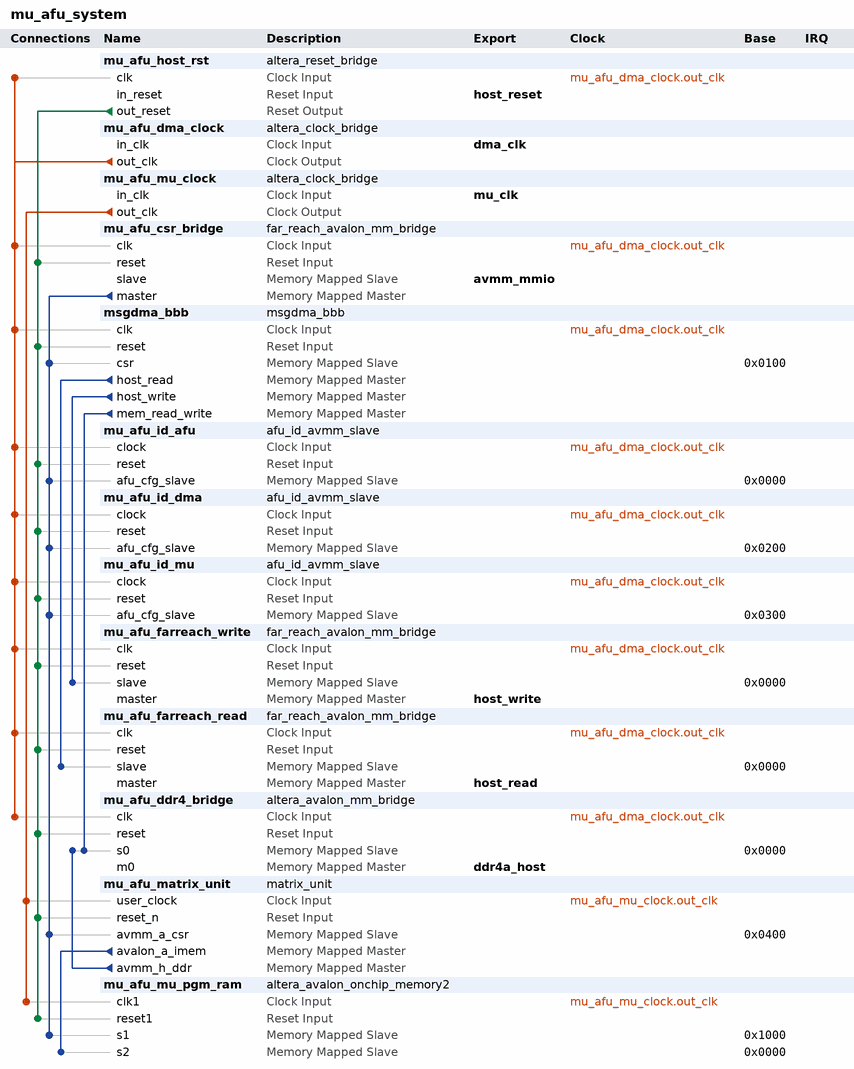
[diagram p0: system contents]
# Platform Designer (Qsys) system mu_afu_system, Stratix 10 1SX280HN2F43E2VG
# Parameters at their usual value, and those the tool derives, are not listed.
package require -exact qsys 1.0
create_system mu_afu_system
set_project_property DEVICE_FAMILY {Stratix 10}
set_project_property DEVICE 1SX280HN2F43E2VG

add_component mu_afu_host_rst ip/mu_afu_system/mu_afu_host_rst.ip altera_reset_bridge mu_afu_host_rst 19.1
load_component mu_afu_host_rst
set_component_parameter_value ACTIVE_LOW_RESET 0
set_component_parameter_value SYNCHRONOUS_EDGES both
set_component_parameter_value SYNC_RESET 0
save_component

add_component mu_afu_dma_clock ip/mu_afu_system/mu_afu_dma_clock.ip altera_clock_bridge mu_afu_dma_clock 19.1
load_component mu_afu_dma_clock
set_component_parameter_value DERIVED_CLOCK_RATE 0
set_component_parameter_value EXPLICIT_CLOCK_RATE 250000000
save_component

add_component mu_afu_mu_clock ip/mu_afu_system/mu_afu_mu_clock.ip altera_clock_bridge mu_afu_mu_clock 19.1
load_component mu_afu_mu_clock
set_component_parameter_value DERIVED_CLOCK_RATE 0
set_component_parameter_value EXPLICIT_CLOCK_RATE 125000000
save_component

add_component mu_afu_csr_bridge ip/mu_afu_system/mu_afu_csr_bridge.ip far_reach_avalon_mm_bridge mu_afu_csr_bridge 1.0
load_component mu_afu_csr_bridge
set_component_parameter_value DATA_WIDTH 64
set_component_parameter_value ADDRESS_WIDTH 48
set_component_parameter_value BURST_COUNT 1
set_component_parameter_value BURST_WIDTH 1
set_component_parameter_value RESPONSE_ENABLE 0
set_component_parameter_value READ_ENABLE 1
set_component_parameter_value MAX_PENDING_READS 64
set_component_parameter_value WRITE_ENABLE 1
set_component_parameter_value MAX_PENDING_WRITES 64
set_component_parameter_value WRITE_TRACKING_ENABLE 0
set_component_parameter_value DOWNSTREAM_PIPELINE_STAGES 2
set_component_parameter_value WAITREQUEST_PIPELINE_STAGES 2
set_component_parameter_value UPSTREAM_PIPELINE_STAGES 2
set_component_parameter_value SKID_FIFO_DEPTH 16
set_component_parameter_value SKID_FIFO_ALMOST_FULL_LEVEL 11
set_component_parameter_value SKID_FIFO_CLOCK_CROSSING_ENABLE 0
set_component_parameter_value UPSTREAM_CLOCK_CROSSING_ENABLE 0
set_component_parameter_value UPSTREAM_FIFO_DEPTH 32
set_component_parameter_value UPSTREAM_FIFO_ALMOST_FULL_LEVEL 10
save_component

add_component msgdma_bbb /home/u204427/ternary_matmul/afu/pd/dma_bbb/msgdma_bbb.qsys msgdma_bbb msgdma_bbb 

add_component mu_afu_id_afu ip/mu_afu_system/mu_afu_id_afu.ip afu_id_avmm_slave mu_afu_id_afu 1.0
load_component mu_afu_id_afu
set_component_parameter_value AFU_ID_H 13801922474960440300
set_component_parameter_value AFU_ID_L 11423231018923234662
set_component_parameter_value DFH_FEATURE_TYPE 1
set_component_parameter_value DFH_AFU_MINOR_REV 0
set_component_parameter_value DFH_AFU_MAJOR_REV 0
set_component_parameter_value DFH_END_OF_LIST 0
set_component_parameter_value DFH_NEXT_OFFSET 256
set_component_parameter_value DFH_FEATURE_ID 0
set_component_parameter_value NEXT_AFU_OFFSET 0
set_component_parameter_value CREATE_SCRATCH_REG 0
save_component

add_component mu_afu_id_dma ip/mu_afu_system/mu_afu_id_dma.ip afu_id_avmm_slave mu_afu_id_dma 1.0
load_component mu_afu_id_dma
set_component_parameter_value AFU_ID_H 15713484274600791587
set_component_parameter_value AFU_ID_L 10447905468530561839
set_component_parameter_value DFH_FEATURE_TYPE 2
set_component_parameter_value DFH_AFU_MINOR_REV 0
set_component_parameter_value DFH_AFU_MAJOR_REV 0
set_component_parameter_value DFH_END_OF_LIST 0
set_component_parameter_value DFH_NEXT_OFFSET 256
set_component_parameter_value DFH_FEATURE_ID 0
set_component_parameter_value NEXT_AFU_OFFSET 0
set_component_parameter_value CREATE_SCRATCH_REG 0
save_component

add_component mu_afu_id_mu ip/mu_afu_system/mu_afu_id_mu.ip afu_id_avmm_slave mu_afu_id_mu 1.0
load_component mu_afu_id_mu
set_component_parameter_value AFU_ID_H 13738515147855644312
set_component_parameter_value AFU_ID_L 11395495359027184417
set_component_parameter_value DFH_FEATURE_TYPE 3
set_component_parameter_value DFH_AFU_MINOR_REV 0
set_component_parameter_value DFH_AFU_MAJOR_REV 1
set_component_parameter_value DFH_END_OF_LIST 1
set_component_parameter_value DFH_NEXT_OFFSET 3840
set_component_parameter_value DFH_FEATURE_ID 2730
set_component_parameter_value NEXT_AFU_OFFSET 0
set_component_parameter_value CREATE_SCRATCH_REG 0
save_component

add_component mu_afu_farreach_write ip/mu_afu_system/mu_afu_farreach_write.ip far_reach_avalon_mm_bridge mu_afu_farreach_write 1.0
load_component mu_afu_farreach_write
set_component_parameter_value DATA_WIDTH 512
set_component_parameter_value ADDRESS_WIDTH 48
set_component_parameter_value BURST_COUNT 4
set_component_parameter_value BURST_WIDTH 3
set_component_parameter_value RESPONSE_ENABLE 1
set_component_parameter_value READ_ENABLE 0
set_component_parameter_value MAX_PENDING_READS 64
set_component_parameter_value WRITE_ENABLE 1
set_component_parameter_value MAX_PENDING_WRITES 64
set_component_parameter_value WRITE_TRACKING_ENABLE 1
set_component_parameter_value DOWNSTREAM_PIPELINE_STAGES 2
set_component_parameter_value WAITREQUEST_PIPELINE_STAGES 2
set_component_parameter_value UPSTREAM_PIPELINE_STAGES 2
set_component_parameter_value SKID_FIFO_DEPTH 16
set_component_parameter_value SKID_FIFO_ALMOST_FULL_LEVEL 11
set_component_parameter_value SKID_FIFO_CLOCK_CROSSING_ENABLE 0
set_component_parameter_value UPSTREAM_CLOCK_CROSSING_ENABLE 0
set_component_parameter_value UPSTREAM_FIFO_DEPTH 32
set_component_parameter_value UPSTREAM_FIFO_ALMOST_FULL_LEVEL 10
save_component

add_component mu_afu_farreach_read ip/mu_afu_system/mu_afu_farreach_read.ip far_reach_avalon_mm_bridge mu_afu_farreach_read 1.0
load_component mu_afu_farreach_read
set_component_parameter_value DATA_WIDTH 512
set_component_parameter_value ADDRESS_WIDTH 48
set_component_parameter_value BURST_COUNT 4
set_component_parameter_value BURST_WIDTH 3
set_component_parameter_value RESPONSE_ENABLE 0
set_component_parameter_value READ_ENABLE 1
set_component_parameter_value MAX_PENDING_READS 64
set_component_parameter_value WRITE_ENABLE 0
set_component_parameter_value MAX_PENDING_WRITES 64
set_component_parameter_value WRITE_TRACKING_ENABLE 0
set_component_parameter_value DOWNSTREAM_PIPELINE_STAGES 2
set_component_parameter_value WAITREQUEST_PIPELINE_STAGES 2
set_component_parameter_value UPSTREAM_PIPELINE_STAGES 2
set_component_parameter_value SKID_FIFO_DEPTH 16
set_component_parameter_value SKID_FIFO_ALMOST_FULL_LEVEL 11
set_component_parameter_value SKID_FIFO_CLOCK_CROSSING_ENABLE 0
set_component_parameter_value UPSTREAM_CLOCK_CROSSING_ENABLE 0
set_component_parameter_value UPSTREAM_FIFO_DEPTH 32
set_component_parameter_value UPSTREAM_FIFO_ALMOST_FULL_LEVEL 10
save_component

add_component mu_afu_ddr4_bridge ip/mu_afu_system/mu_afu_ddr4_bridge.ip altera_avalon_mm_bridge mu_afu_ddr4_bridge 19.1
load_component mu_afu_ddr4_bridge
set_component_parameter_value DATA_WIDTH 512
set_component_parameter_value ADDRESS_WIDTH 33
set_component_parameter_value USE_AUTO_ADDRESS_WIDTH 0
set_component_parameter_value ADDRESS_UNITS SYMBOLS
set_component_parameter_value MAX_BURST_SIZE 4
set_component_parameter_value MAX_PENDING_RESPONSES 64
set_component_parameter_value SYNC_RESET 0
save_component

add_component mu_afu_matrix_unit ip/mu_afu_system/mu_afu_matrix_unit.ip matrix_unit mu_afu_matrix_unit 1.0
load_component mu_afu_matrix_unit
set_component_parameter_value ddr_addr_w 33
set_component_parameter_value ddr_data_w 8
set_component_parameter_value csr_addr_w 8
set_component_parameter_value csr_data_w 32
set_component_parameter_value imem_w_instr 64
set_component_parameter_value imem_w_addr 6
save_component

add_component mu_afu_mu_pgm_ram ip/mu_afu_system/mu_afu_mu_pgm_ram.ip altera_avalon_onchip_memory2 mu_afu_mu_pgm_ram 19.1
load_component mu_afu_mu_pgm_ram
set_component_parameter_value blockType M20K
set_component_parameter_value dataWidth 64
set_component_parameter_value dualPort true
set_component_parameter_value initMemContent false
set_component_parameter_value initializationFileName onchip_mem.hex
set_component_parameter_value memorySize 512
set_component_parameter_value resetrequest_enabled false
save_component

# connections
add_connection mu_afu_dma_clock.out_clk msgdma_bbb.clk clock
add_connection mu_afu_dma_clock.out_clk mu_afu_csr_bridge.clk clock
add_connection mu_afu_dma_clock.out_clk mu_afu_ddr4_bridge.clk clock
add_connection mu_afu_dma_clock.out_clk mu_afu_farreach_read.clk clock
add_connection mu_afu_dma_clock.out_clk mu_afu_farreach_write.clk clock
add_connection mu_afu_dma_clock.out_clk mu_afu_host_rst.clk clock
add_connection mu_afu_dma_clock.out_clk mu_afu_id_afu.clock clock
add_connection mu_afu_dma_clock.out_clk mu_afu_id_dma.clock clock
add_connection mu_afu_dma_clock.out_clk mu_afu_id_mu.clock clock
add_connection mu_afu_mu_clock.out_clk mu_afu_matrix_unit.user_clock clock
add_connection mu_afu_mu_clock.out_clk mu_afu_mu_pgm_ram.clk1 clock
add_connection mu_afu_host_rst.out_reset msgdma_bbb.reset reset
add_connection mu_afu_host_rst.out_reset mu_afu_csr_bridge.reset reset
add_connection mu_afu_host_rst.out_reset mu_afu_ddr4_bridge.reset reset
add_connection mu_afu_host_rst.out_reset mu_afu_farreach_read.reset reset
add_connection mu_afu_host_rst.out_reset mu_afu_farreach_write.reset reset
add_connection mu_afu_host_rst.out_reset mu_afu_id_afu.reset reset
add_connection mu_afu_host_rst.out_reset mu_afu_id_dma.reset reset
add_connection mu_afu_host_rst.out_reset mu_afu_id_mu.reset reset
add_connection mu_afu_host_rst.out_reset mu_afu_matrix_unit.reset_n reset
add_connection mu_afu_host_rst.out_reset mu_afu_mu_pgm_ram.reset1 reset
add_connection msgdma_bbb.host_read mu_afu_farreach_read.slave avalon
set_connection_parameter_value msgdma_bbb.host_read/mu_afu_farreach_read.slave baseAddress 0x0000
add_connection msgdma_bbb.host_write mu_afu_farreach_write.slave avalon
set_connection_parameter_value msgdma_bbb.host_write/mu_afu_farreach_write.slave baseAddress 0x0000
add_connection msgdma_bbb.mem_read_write mu_afu_ddr4_bridge.s0 avalon
set_connection_parameter_value msgdma_bbb.mem_read_write/mu_afu_ddr4_bridge.s0 baseAddress 0x0000
add_connection mu_afu_csr_bridge.master msgdma_bbb.csr avalon
set_connection_parameter_value mu_afu_csr_bridge.master/msgdma_bbb.csr baseAddress 0x0100
add_connection mu_afu_csr_bridge.master mu_afu_id_afu.afu_cfg_slave avalon
set_connection_parameter_value mu_afu_csr_bridge.master/mu_afu_id_afu.afu_cfg_slave baseAddress 0x0000
add_connection mu_afu_csr_bridge.master mu_afu_id_dma.afu_cfg_slave avalon
set_connection_parameter_value mu_afu_csr_bridge.master/mu_afu_id_dma.afu_cfg_slave baseAddress 0x0200
add_connection mu_afu_csr_bridge.master mu_afu_id_mu.afu_cfg_slave avalon
set_connection_parameter_value mu_afu_csr_bridge.master/mu_afu_id_mu.afu_cfg_slave baseAddress 0x0300
add_connection mu_afu_csr_bridge.master mu_afu_matrix_unit.avmm_a_csr avalon
set_connection_parameter_value mu_afu_csr_bridge.master/mu_afu_matrix_unit.avmm_a_csr baseAddress 0x0400
add_connection mu_afu_csr_bridge.master mu_afu_mu_pgm_ram.s1 avalon
set_connection_parameter_value mu_afu_csr_bridge.master/mu_afu_mu_pgm_ram.s1 baseAddress 0x1000
add_connection mu_afu_matrix_unit.avalon_a_imem mu_afu_mu_pgm_ram.s2 avalon
set_connection_parameter_value mu_afu_matrix_unit.avalon_a_imem/mu_afu_mu_pgm_ram.s2 baseAddress 0x0000
add_connection mu_afu_matrix_unit.avmm_h_ddr mu_afu_ddr4_bridge.s0 avalon
set_connection_parameter_value mu_afu_matrix_unit.avmm_h_ddr/mu_afu_ddr4_bridge.s0 baseAddress 0x0000

# exported interfaces
add_interface avmm_mmio avalon slave
set_interface_property avmm_mmio EXPORT_OF mu_afu_csr_bridge.slave
add_interface ddr4a_host avalon master
set_interface_property ddr4a_host EXPORT_OF mu_afu_ddr4_bridge.m0
add_interface dma_clk clock sink
set_interface_property dma_clk EXPORT_OF mu_afu_dma_clock.in_clk
add_interface host_read avalon master
set_interface_property host_read EXPORT_OF mu_afu_farreach_read.master
add_interface host_reset reset sink
set_interface_property host_reset EXPORT_OF mu_afu_host_rst.in_reset
add_interface host_write avalon master
set_interface_property host_write EXPORT_OF mu_afu_farreach_write.master
add_interface mu_clk clock sink
set_interface_property mu_clk EXPORT_OF mu_afu_mu_clock.in_clk

save_system mu_afu_system.qsys
